# Altium schematic sheet STM32 - MCU.SchDoc: ETHERNET SWITCH LAYER 2
size A3; DrawnBy: Luca Schenetti; Revision: C; SheetNumber: 5; SheetTotal: 5
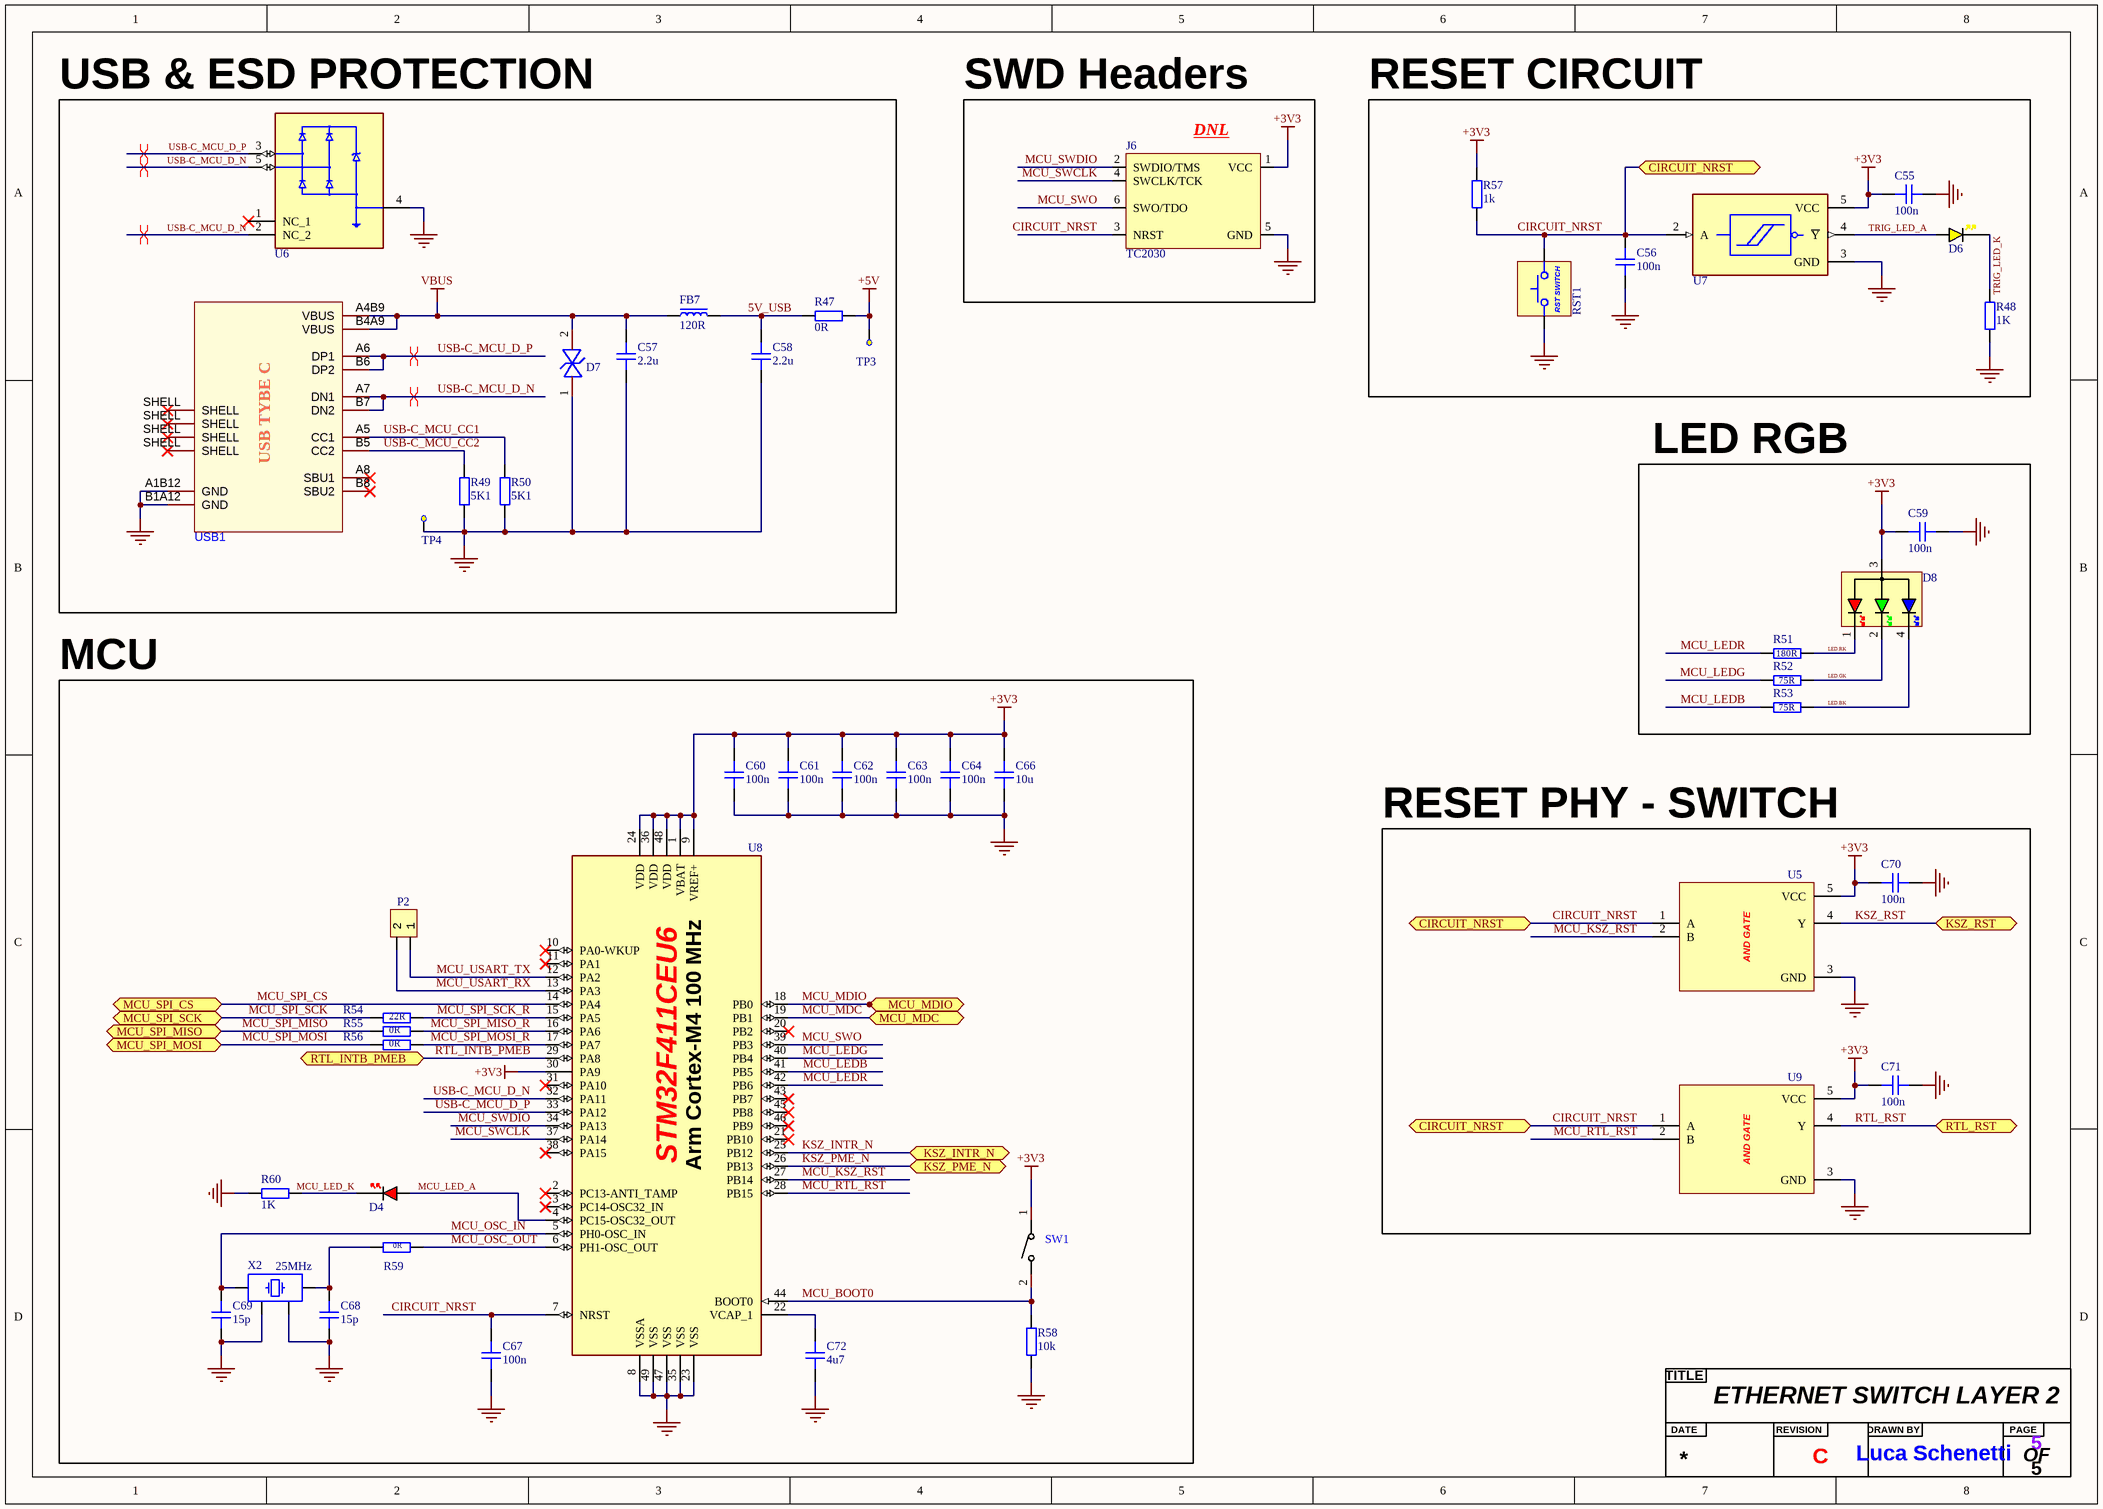
[diagram p0: STM32 - MCU.SchDoc]

## Parts
?  Title  (value not drawn)  (graphical)
C55  100n  [CAP_0402]
C56  100n  [CAP_0402]
C57  2.2u  [CAP_0603]
C58  2.2u  [CAP_0603]
C59  100n  [CAP_0402]
C60  100n  [CAP_0603]
C61  100n  [CAP_0603]
C62  100n  [CAP_0603]
C63  100n  [CAP_0603]
C64  100n  [CAP_0603]
C66  10u  [CAP_0603]
C67  100n  [CAP_0603]
C68  15p  [CAP_0402]
C69  15p  [CAP_0402]
C70  100n  [CAP_0402]
C71  100n  [CAP_0402]
C72  4u7  [CAP_0603]
D4  RED  [LED_0603_RED]  (value not drawn)
D6  YELLOW  [LED_0603_YELLOW]  (value not drawn)
D7  ESD Protection TVS 6.0V  [SMF6.0CA]  (value not drawn)
D8  RGB_LED  [XL-2012RGBC]  (value not drawn)
FB7  120R  [FB_0603]
J6  TC2030  [TC2030-FP]  (no BOM)
P2  HDR1x2  [HDR1X2_2.54_180]  (value not drawn)
R47  0R  [RES_0603]
R48  1K  [RES_0402]
R49  5K1  [RES_0603]
R50  5K1  [RES_0603]
R51  180R  [RES_0603]
R52  75R  [RES_0603]
R53  75R  [RES_0603]
R54  22R  [RES_0402]
R55  0R  [RES_0402]
R56  0R  [RES_0402]
R57  1k  [RES_0402]
R58  10k  [RES_0603]
R59  0R  [RES_0402]
R60  1K  [RES_0402]
RST1  RST_SWITCH_STM32  [RST_SWITCH]  (value not drawn)
SW1  TS-1088-AR02016  [TS-1088-AR02016]  (value not drawn)
TP3  Test Point  [Test Point]  (value not drawn)
TP4  Test Point  [Test Point]  (value not drawn)
U5  AND GATE  [SN74LVC1G08DBVR]  (value not drawn)
U6  TVS USB 2.0 ±25-kV  [TPD2E2U06DRLR]  (value not drawn)
U7  Schmitt Trigger 1.65V~5.5V  [74LVC1G14GW,125]  (value not drawn)
U8  ARM® Cortex®-M4 STM32F4  [STM32F411CEU6]  (value not drawn)
U9  AND GATE  [SN74LVC1G08DBVR]  (value not drawn)
USB1  USB-C CONNECTOR  [USB-3.1-SMD_U262-161N-4BVC11]  (value not drawn)
X2  25MHz  [XTAL_3225]

## Blocks framed on the sheet
USB & ESD PROTECTION: C57 C58 D7 FB7 R47 R49 R50 TP3 TP4 U6 USB1
SWD Headers: J6
RESET CIRCUIT: C55 C56 D6 R48 R57 RST1 U7
LED RGB: C59 D8 R51-R53
MCU: C60-C64 C66-C69 C72 D4 P2 R54-R56 R58-R60 SW1 U8 X2
RESET PHY - SWITCH: C70 C71 U5 U9

## Ports
CIRCUIT_NRST (bidir, see STM32 - MCU[6C]), CIRCUIT_NRST (bidir, see STM32 - MCU[6C], STM32 - MCU[7A]), KSZ_INTR_N (bidir, see KSZ - ETH HUB[1B]), KSZ_PME_N (bidir, see KSZ - ETH HUB[1B]), KSZ_RST (bidir, see KSZ - ETH HUB[3B]), MCU_MDC (bidir, see RTL - ETH PHY[1B]), MCU_MDIO (bidir, see RTL - ETH PHY[1B]), MCU_SPI_CS (bidir, see KSZ - ETH HUB[2C]), MCU_SPI_MISO (bidir, see KSZ - ETH HUB[2C]), MCU_SPI_MOSI (bidir, see KSZ - ETH HUB[2C]), MCU_SPI_SCK (bidir, see KSZ - ETH HUB[2C]), RTL_INTB_PMEB (bidir, see RTL - ETH PHY[1C]), RTL_RST (bidir, see RTL - ETH PHY[3C])

## Nets
+3V3: C55.2 C59.2 C60.2 C61.2 C62.2 C63.2 C64.2 C66.2 C70.2 C71.2 D8.3(AC) J6.1(VCC) R57.2 SW1.1 U5.5(VCC) U7.5(VCC) U8.1(VBAT) U8.9(VREF+) U8.24(VDD) U8.30(PA9) U8.36(VDD) U8.48(VDD) U9.5(VCC)
+5V: R47.2 TP3.1(Test_Point)
GND: C55.1 C56.1 C57.1 C58.1 C59.1 C60.1 C61.1 C62.1 C63.1 C64.1 C66.1 C67.1 C68.1 C69.1 C70.1 C71.1 C72.1 D7.1(C) J6.5(GND) R48.1 R49.1 R50.1 R58.1 R60.1 RST1.1 TP4.1(Test_Point) U5.3(GND) U6.4(GND) U7.3(GND) U8.8(VSSA) U8.23(VSS) U8.35(VSS) U8.47(VSS) U8.49(VSS) U9.3(GND) USB1.A1B12(GND) USB1.B1A12(GND) X2.2 X2.4
VBUS: C57.2 D7.2(A) FB7.1 USB1.A4B9(VBUS) USB1.B4A9(VBUS)
5V_USB: C58.2 FB7.2 R47.1
CIRCUIT_NRST: C56.2 C67.2 J6.3(NRST) R57.1 RST1.2 U5.1(A) U7.2(A) U8.7(NRST) U9.1(A) ; port CIRCUIT_NRST
KSZ_INTR_N: U8.25(PB12) ; port KSZ_INTR_N
KSZ_PME_N: U8.26(PB13) ; port KSZ_PME_N
KSZ_RST: U5.4(Y) ; port KSZ_RST
LED.BK: D8.4(CB) R53.1
LED.GK: D8.2(CG) R52.1
LED.RK: D8.1(CR) R51.1
MCU_BOOT0: R58.2 SW1.2 U8.44(BOOT0)
MCU_KSZ_RST: U5.2(B) U8.27(PB14)
MCU_LED_A: D4.A U8.4(PC15-OSC32_OUT)
MCU_LED_K: D4.K R60.2
MCU_LEDB: R53.2 U8.41(PB5)
MCU_LEDG: R52.2 U8.40(PB4)
MCU_LEDR: R51.2 U8.42(PB6)
MCU_MDC: U8.19(PB1) ; port MCU_MDC
MCU_MDIO: U8.18(PB0) ; port MCU_MDIO
MCU_OSC_IN: C69.2 U8.5(PH0-OSC_IN) X2.3
MCU_OSC_OUT: R59.2 U8.6(PH1-OSC_OUT)
MCU_RTL_RST: U8.28(PB15) U9.2(B)
MCU_SPI_CS: U8.14(PA4) ; port MCU_SPI_CS
MCU_SPI_MISO: R55.1 ; port MCU_SPI_MISO
MCU_SPI_MISO_R: R55.2 U8.16(PA6)
MCU_SPI_MOSI: R56.1 ; port MCU_SPI_MOSI
MCU_SPI_MOSI_R: R56.2 U8.17(PA7)
MCU_SPI_SCK: R54.1 ; port MCU_SPI_SCK
MCU_SPI_SCK_R: R54.2 U8.15(PA5)
MCU_SWCLK: J6.4(SWCLK/TCK) U8.37(PA14)
MCU_SWDIO: J6.2(SWDIO/TMS) U8.34(PA13)
MCU_SWO: J6.6(SWO/TDO) U8.39(PB3)
MCU_USART_RX: P2.2 U8.13(PA3)
MCU_USART_TX: P2.1 U8.12(PA2)
RTL_INTB_PMEB: U8.29(PA8) ; port RTL_INTB_PMEB
RTL_RST: U9.4(Y) ; port RTL_RST
TRIG_LED_A: D6.A U7.4(~{Y})
TRIG_LED_K: D6.K R48.2
USB-C_MCU_CC1: R50.2 USB1.A5(CC1)
USB-C_MCU_CC2: R49.2 USB1.B5(CC2)
USB-C_MCU_D_N: U6.2(NC_2) U6.5(IO2) U8.32(PA11) USB1.A7(DN1) USB1.B7(DN2)
USB-C_MCU_D_P: U6.3(IO1) U8.33(PA12) USB1.A6(DP1) USB1.B6(DP2)
NetC68_2: C68.2 R59.1 X2.1
NetC72_2: C72.2 U8.22(VCAP_1)

Not connected (* = marked no-connect by the designer): U6 1(NC_1)*; U8 2(PC13-ANTI_TAMP)* 3(PC14-OSC32_IN)* 10(PA0-WKUP)* 11(PA1)* 20(PB2)* 21(PB10)* 31(PA10)* 38(PA15)* 43(PB7)* 45(PB8)* 46(PB9)*; USB1 A8(SBU1)* B8(SBU2)* SHELL*

## Layout directives
differential pair; differential pair class DIFF_USB_90Ω: USB-C_MCU_D_N, USB-C_MCU_D_P

## Notes on the sheet
- (near J6) DNL
- (in symbol RST_SWITCH) RST SWITCH
- (in symbol STM32F411CEU6) Arm Cortex-M4 100 MHz
- (in symbol Title) TITLE; DATE; REVISION; DRAWN BY; PAGE; OF
- (in symbol U262-161N-4BVC11) USB TYBE C

## Library data of the parts
C55 C56 C59 C70 C71 = CAP_0402: Capacitor SMD 0402 [C1525]; Manufacturer: *; Manufacturer Part Number: *; Distributor Link: *; LCSC: *; Rating: *; Dielectric: *
C57 C58 = CAP_0603: Capacitor SMD 0603 [C23630]; Manufacturer: *; Manufacturer Part Number: *; Distributor Link: *; LCSC: *; Rating: *; Dielectric: *
C60-C64 C67 = CAP_0603: Capacitor SMD 0603 [C14663]; Manufacturer: *; Manufacturer Part Number: *; Distributor Link: *; LCSC: *; Rating: *; Dielectric: *
C66 = CAP_0603: Capacitor SMD 0603 [C96446]; Manufacturer: *; Manufacturer Part Number: *; Distributor Link: *; LCSC: *; Rating: *; Dielectric: *
C68 C69 = CAP_0402: Capacitor SMD 0402 [C1548]; Manufacturer: *; Manufacturer Part Number: *; Distributor Link: *; LCSC: *; Rating: *; Dielectric: *
C72 = CAP_0603: Capacitor SMD 0603 [C19666]; Manufacturer: *; Manufacturer Part Number: *; Distributor Link: *; LCSC: *; Rating: *; Dielectric: *
D4 = LED_0603_RED: LED 0603 RED SMD[C2926776]
D6 = LED_0603_YELLOW: LED 0603 YELLOW SMD[C72038]
D7 = SMF6.0CA: [C2990473]
D8 = RGB_LED_0805: [C965848]
FB7 = FB_0603: Ferrite Bead SMD 0603[C76892]; Manufacturer: *; Manufacturer Part Number: *; Distributor Link: *; LCSC: *
J6 = TC2030: Tag-Connect No-Solder SWD Debug Connector DO NOT PLACE; Manufacturer: Tag-Connect; Manufacturer Part Number: TC2030
P2 = HDR1x2_2.54T: Header; Value: 2.54; Type: DIP 1x2
R47 = RES_0603: [C21189]; Manufacturer: *; Manufacturer Part Number: *; Distributor Link: *; LCSC: *
R48 R57 R60 = RES_0402: Resistor SMD 0402 [C11702]; Manufacturer: *; Manufacturer Part Number: *; Distributor Link: *; LCSC: *
R49 R50 = RES_0603: [C23186]; Manufacturer: *; Manufacturer Part Number: *; Distributor Link: *; LCSC: *
R51 = RES_0603: [C22828]; Manufacturer: *; Manufacturer Part Number: *; Distributor Link: *; LCSC: *
R52 R53 = RES_0603: [C4275]; Manufacturer: *; Manufacturer Part Number: *; Distributor Link: *; LCSC: *
R54 = RES_0402: Resistor SMD 0402 [C25092]; Manufacturer: *; Manufacturer Part Number: *; Distributor Link: *; LCSC: *
R55 R56 R59 = RES_0402: Resistor SMD 0402 [C17168]; Manufacturer: *; Manufacturer Part Number: *; Distributor Link: *; LCSC: *
R58 = RES_0603: Resistor SMD 0603[C25804]; Manufacturer: *; Manufacturer Part Number: *; Distributor Link: *; LCSC: *
RST1 = RST_SWITCH: [C720477]
SW1 = TS-1088-AR02016: [C720477]; Manufacturer: XUNPU(讯普); Add into BOM: yes; Circuit: SPST; Actuator Style: Round Button; Operating Force: 160gf; Switch Length: 4mm; Switch Width: 3mm; Switch Height: 2mm; Strike Gundam: 不带; Contact Current: 50mA; Voltage Rating (DC): 12V; Insulation Resistance: 100MΩ; Actuator/Cap Color: Black; Pin Style: SMDSplicing; Mechanical Life: 10万次; Symbol: TS-1088-AR02016; Device: TS-1088-AR02016; Supplier: LCSC; Supplier Part: C720477; Manufacturer Part: TS-1088-AR02016; JLCPCB Part Class: Extended Part; LCSC Part Name: 4*3*2mm 立贴 轻触开关; Supplier Footprint: SMD; Datasheet: https://atta.szlcsc.com/upload/public/pdf/source/20200810/C720475_60D09DD6C54279ADDB2DC25100F1CC11.pdf; Convert to PCB: yes; Mounting Style: Brick nogging; Operating Temperature: -30℃~+80℃
U5 U9 = SN74LVC1G08DBVR: [C7666]
U6 = TPD2E2U06DRLR: [C1972959]
U7 = 74LVC1G14GW,125: [C265125]
U8 = STM32F411CEU6: [C60420]
USB1 = U262-161N-4BVC11: [C319148]; Manufacturer: XKB Connectivity(中国星坤); Symbol: U262-16XN-4BVC11; Add into BOM: yes; Connector Type: Type-C; Gender: Female; Number of Ports: 1; Number of Contacts: 16P; Current Rating - Power (Max): 3A; Soldering Temperature(Max): 260℃; Device: U262-161N-4BVC11; LCSC Part Name: Type-C 母 卧贴; Supplier Part: C319148; Manufacturer Part: U262-161N-4BVC11; Supplier Footprint: SMD; JLCPCB Part Class: Extended Part; Datasheet: https://atta.szlcsc.com/upload/public/pdf/source/20211015/B478CBA0F1623DA36A6CC6918C49C838.pdf; Supplier: LCSC; Convert to PCB: yes; Standard: USB 3.1; Mounting Style: 卧贴; Contact Material: Copper Alloy; Contact Plating: Gold; Operating Temperature Range: -40℃~+85℃
X2 = TSX-3225_24.0000MF15X-AC: Crystal SMD 24MHz 10PPM 7pF 3225 [C9006]; Manufacturer: Epson; Manufacturer Part Number: TSX-3225 24.0000MF15X-AC
TP3 TP4 = Test Point: Value: Test Point